# EAGLE design joy (EAGLE 5.01)
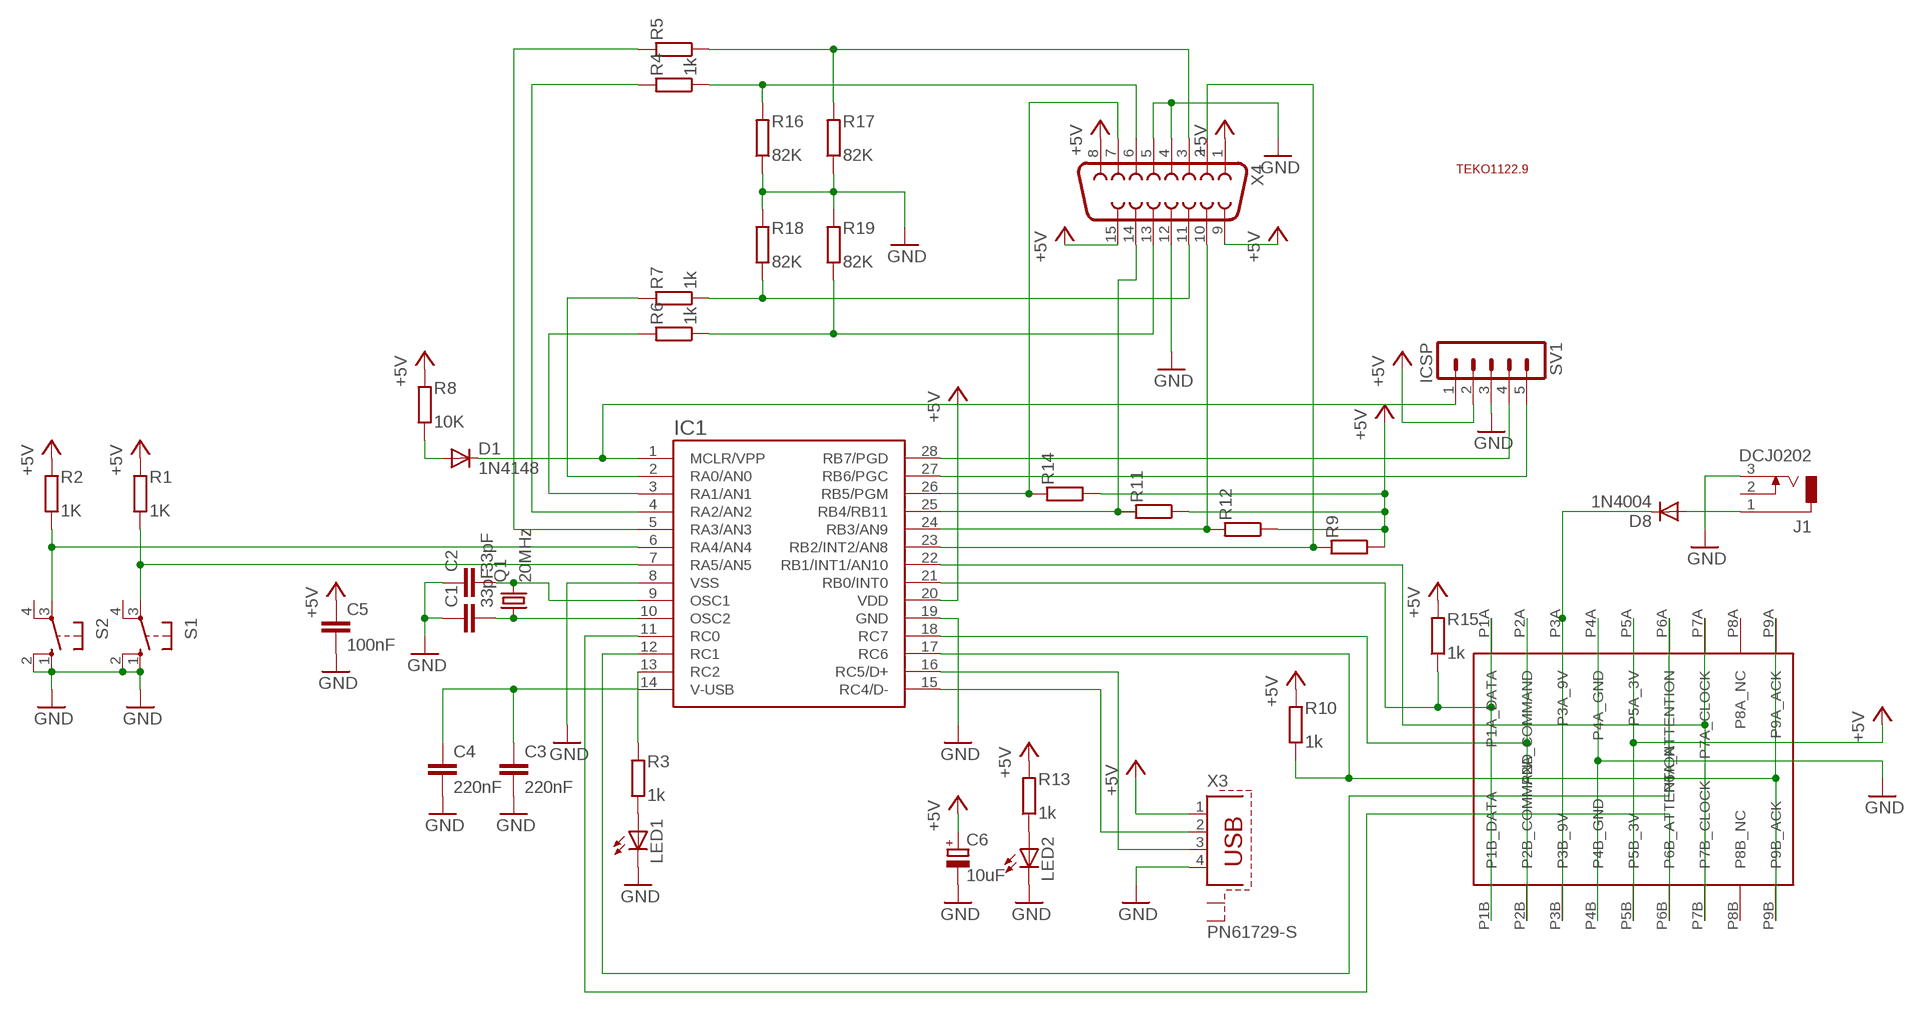
[diagram p0: schematic, sheet 1]

## Parts
C1  33pF  C-EU050-025X075  [C050-025X075]
C2  33pF  C-EU050-025X075  [C050-025X075]
C3  220nF  C-EU050-025X075  [C050-025X075]
C4  220nF  C-EU050-025X075  [C050-025X075]
C5  100nF  C-EU050-025X075  [C050-025X075]
C6  10uF  CPOL-EUE2,5-6E  [E2,5-6E]
D1  1N4148  [DO35-10]
D8  1N4004  [DO41-10]
IC1  PIC18F2550DIL-28  [DIL28]
J1  DCJ0202  [DCJ0202]
LED1  LED3MM  [LED3MM]
LED2  LED3MM  [LED3MM]
Q1  20MHz  CRYSTALHC49U-V  [HC49U-V]
R1  1K  R-EU_0207/10  [0207/10]
R2  1K  R-EU_0207/10  [0207/10]
R3  1k  R-EU_0207/10  [0207/10]
R4  1k  R-EU_0207/10  [0207/10]
R5  1k  R-EU_0207/10  [0207/10]
R6  1k  R-EU_0207/10  [0207/10]
R7  1k  R-EU_0207/10  [0207/10]
R8  10K  R-EU_0207/10  [0207/10]
R9  1k  R-EU_0207/10  [0207/10]
R10  1k  R-EU_0207/10  [0207/10]
R11  1k  R-EU_0207/10  [0207/10]
R12  1k  R-EU_0207/10  [0207/10]
R13  1k  R-EU_0207/10  [0207/10]
R14  1k  R-EU_0207/10  [0207/10]
R15  1k  R-EU_0207/10  [0207/10]
R16  82K  R-EU_0207/10  [0207/10]
R17  82K  R-EU_0207/10  [0207/10]
R18  82K  R-EU_0207/10  [0207/10]
R19  82K  R-EU_0207/10  [0207/10]
S1  10-XX  [B3F-10XX]
S2  10-XX  [B3F-10XX]
SV1  ICSP  MA05-1  [MA05-1]
U$1  TEKO1122.9  [TEKO1122.9]
U$2  PSX_CON_FEMALE  [PSX_FEMALE_COM]
X3  PN61729-S  [PN61729-S]
X4  F15V  [F15V]

## Nets
+5V: C5.1 C6.+ IC1.20(VDD) R1.2 R2.2 R8.2 R9.1 R10.2 R11.1 R12.1 R13.2 R14.1 R15.2 SV1.2 U$2.P5A(P5A_3V) U$2.P5B(P5B_3V) X3.1 X4.1 X4.8 X4.9 X4.15
GND: C1.1 C2.1 C3.2 C4.2 C5.2 C6.- IC1.8(VSS) IC1.19(GND) J1.3 LED1.K(C) LED2.K(C) R16.1 R17.1 R18.2 R19.2 S1.1(S) S1.2(S1) S2.1(S) S2.2(S1) SV1.3 U$2.P4A(P4A_GND) U$2.P4B(P4B_GND) X3.4 X4.4 X4.5 X4.12
N$1: D1.C IC1.1(MCLR/VPP) SV1.1
N$2: IC1.15(RC4/D-) X3.2
N$3: IC1.16(RC5/D+) X3.3
N$4: C3.1 C4.1 IC1.14(V-USB)
N$5: IC1.28(RB7/PGD) SV1.4
N$6: IC1.27(RB6/PGC) SV1.5
N$7: R5.1 R17.2 X4.3
N$8: R4.1 R16.2 X4.6
N$9: IC1.2(RA0/AN0) R7.2
N$10: C2.2 IC1.9(OSC1) Q1.2
N$11: IC1.3(RA1/AN1) R6.2
N$12: C1.2 IC1.10(OSC2) Q1.1
N$13: R6.1 R19.1 X4.13
N$14: R7.1 R18.1 X4.11
N$15: IC1.4(RA2/AN2) R4.2
N$16: IC1.5(RA3/AN3) R5.2
N$17: IC1.26(RB5/PGM) R14.2 X4.7
N$18: IC1.25(RB4/RB11) R11.2 X4.14
N$19: IC1.24(RB3/AN9) R12.2 X4.10
N$20: IC1.23(RB2/INT2/AN8) R9.2 X4.2
N$21: IC1.6(RA4/AN4) R2.1 S2.3(P)
N$22: IC1.7(RA5/AN5) R1.1 S1.3(P)
N$23: IC1.22(RB1/INT1/AN10) U$2.P7A(P7A_CLOCK) U$2.P7B(P7B_CLOCK)
N$24: IC1.21(RB0/INT0) R15.1 U$2.P1A(P1A_DATA) U$2.P1B(P1B_DATA)
N$25: IC1.18(RC7) U$2.P2A(P2A_COMMAND) U$2.P2B(P2B_COMMAND)
N$26: IC1.17(RC6) R10.1 U$2.P9A(P9A_ACK) U$2.P9B(P9B_ACK)
N$27: IC1.11(RC0) U$2.P6B(P6B_ATTENTION)
N$28: IC1.12(RC1) U$2.P6A(P6A_ATTENTION)
N$29: LED1.A R3.1
N$30: IC1.13(RC2) R3.2
N$31: D8.A J1.1
N$32: D8.C U$2.P3A(P3A_9V) U$2.P3B(P3B_9V)
N$40: D1.A R8.1
N$92: LED2.A R13.1
Unconnected: J1.2 S1.4(P1) S2.4(P1) U$2.P8A(P8A_NC) U$2.P8B(P8B_NC) X3.S1 X3.S2

## Library data of the parts
C1-C5 = rcl:C-EU: CAPACITOR, European symbol
C6 = rcl:CPOL-EU: POLARIZED CAPACITOR, European symbol
D1 = diode:1N4148: DIODE high speed (Philips)
D8 = diode:1N4004: DIODE general purpose rectifier, 1 A
IC1 = pic18f2550:PIC18F2550: PIC18F2550 Richard Myrick T. Arellaga April 2010
J1 = con-jack:DCJ0202: DC POWER JACK Source: DCJ0202.pdf
LED1 LED2 = led:LED: LED OSRAM: - CHIPLED LG R971, LG N971, LY N971, LG Q971, LY Q971, LO R971, LY R971 LH N974, LH R974 LS Q976, LO Q976, LY Q976 LO Q996 - Hyper CHIPLED LW Q18S LB Q993, LB Q99A, LB R99A - SideLED LS A670, LO A670, LY A670, LG A670, LP A670 LB A673, LV A673, LT A673, LW A673 LH A674 LY A675 LS A676, LA A676, LO A676, LY A676, LW A676 LS A679, LY A679, LG A679 - Hyper Micro SIDELED® LS Y876, LA Y876, LO Y876, LY Y876 LT Y87S - SmartLED LW L88C, LW L88S LB L89C, LB L89S, LG L890 LS L89K, LO L89K, LY L89K LS L896, LA L896, LO L896, LY L896 - TOPLED LS T670, LO T670, LY T670, LG T670, LP T670 LSG T670, LSP T670, LSY T670, LOP T670, LYG T670 LG T671, LOG T671, LSG T671 LB T673, LV T673, LT T673, LW T673 LH T674 LS T676, LA T676, LO T676, LY T676, LB T676, LH T676, LSB T676, LW T676 LB T67C, LV T67C, LT T67C, LS T67K, LO T67K, LY T67K, LW E67C LS E67B, LA E67B, LO E67B, LY E67B, LB E67C, LV E67C, LT E67C LW T67C LS T679, LY T679, LG T679 LS T770, LO T770, LY T770, LG T770, LP T770 LB T773, LV T773, LT T773, LW T773 LH T774 LS E675, LA E675, LY E675, LS T675 LS T776, LA T776, LO T776, LY T776, LB T776 LHGB T686 LT T68C, LB T68C - Hyper Mini TOPLED® LB M676 - Mini TOPLED Santana® LG M470 LS M47K, LO M47K, LY M47K Source: http://www.osram.convergy.de - LUMILED® LXK2-PW12-R00, LXK2-PW12-S00, LXK2-PW14-U00, LXK2-PW14-V00 LXK2-PM12-R00, LXK2-PM12-S00, LXK2-PM14-U00 LXK2-PE12-Q00, LXK2-PE12-R00, LXK2-PE12-S00, LXK2-PE14-T00, LXK2-PE14-U00 LXK2-PB12-K00, LXK2-PB12-L00, LXK2-PB12-M00, LXK2-PB14-N00, LXK2-PB14-P00, LXK2-PB14-Q00 LXK2-PR12-L00, LXK2-PR12-M00, LXK2-PR14-Q00, LXK2-PR14-R00 LXK2-PD12-Q00, LXK2-PD12-R00, LXK2-PD12-S00 LXK2-PH12-R00, LXK2-PH12-S00 LXK2-PL12-P00, LXK2-PL12-Q00, LXK2-PL12-R00 Source: www.luxeon.com
Q1 = crystal:CRYSTAL: CRYSTAL
R1-R19 = rcl:R-EU_: RESISTOR, European symbol
S1 S2 = switch-omron:10-XX: OMRON SWITCH
SV1 = con-lstb:MA05-1: PIN HEADER
U$1 = nuccio_lib:TEKO1122.9
U$2 = nuccio_lib:PSX_CON_FEMALE
X3 = con-berg:PN61729-S: BERG USB connector
X4 = con-subd:F15: SUB-D

## Board
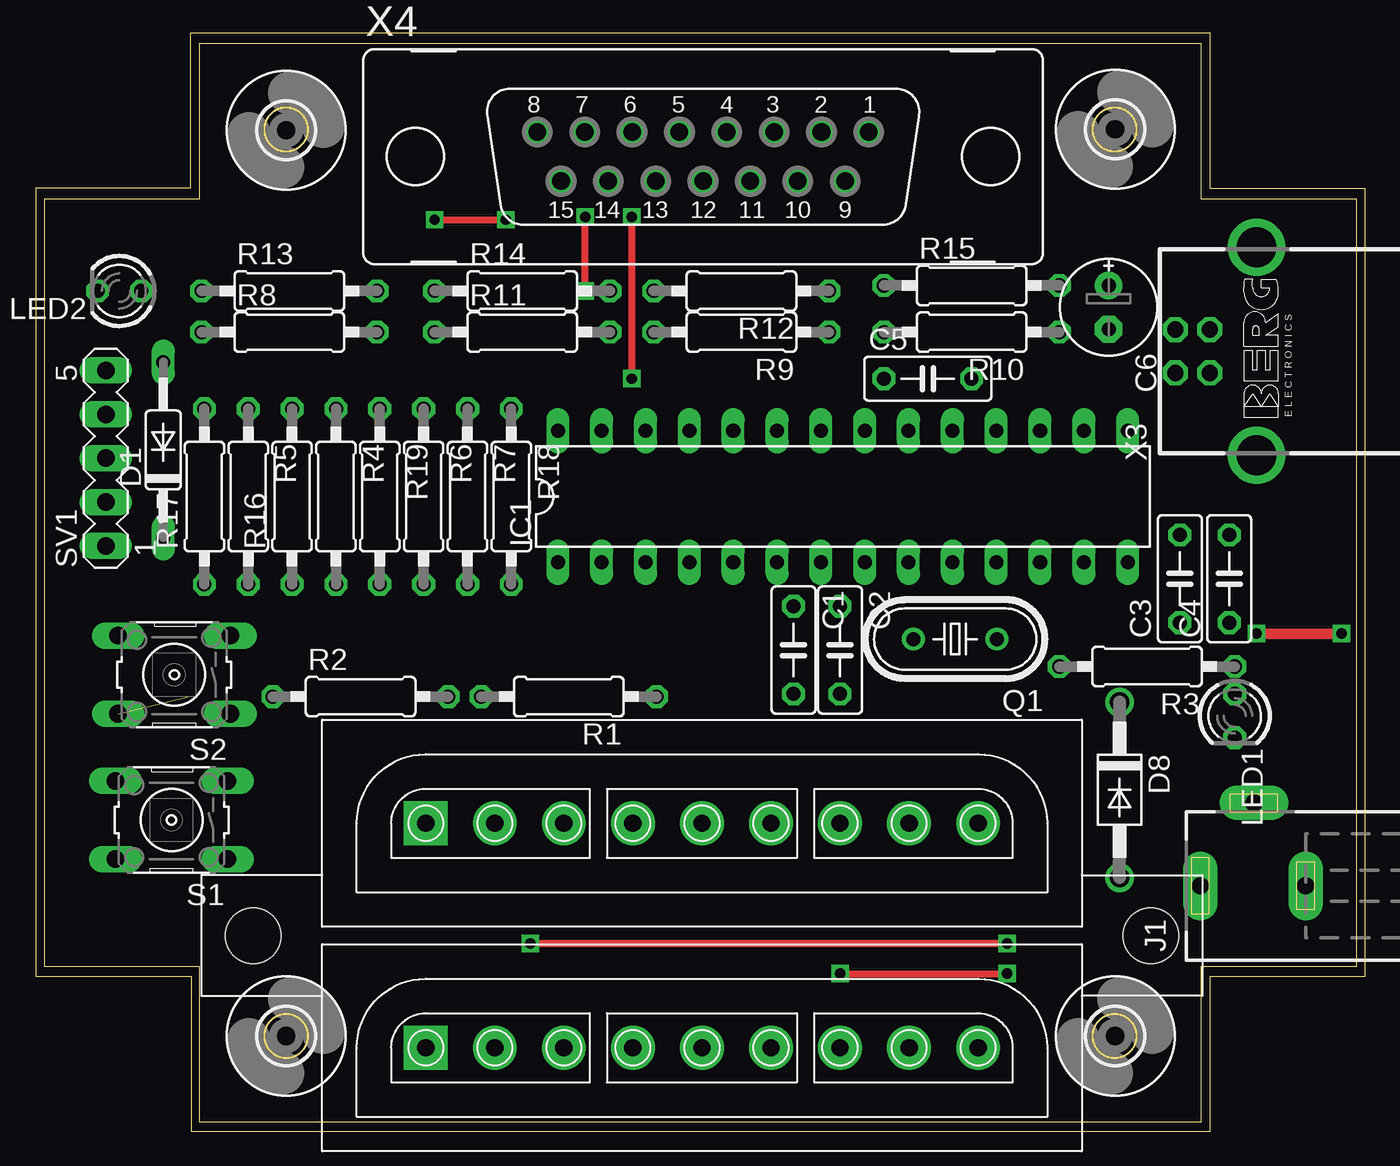
[diagram p1: board, top side]
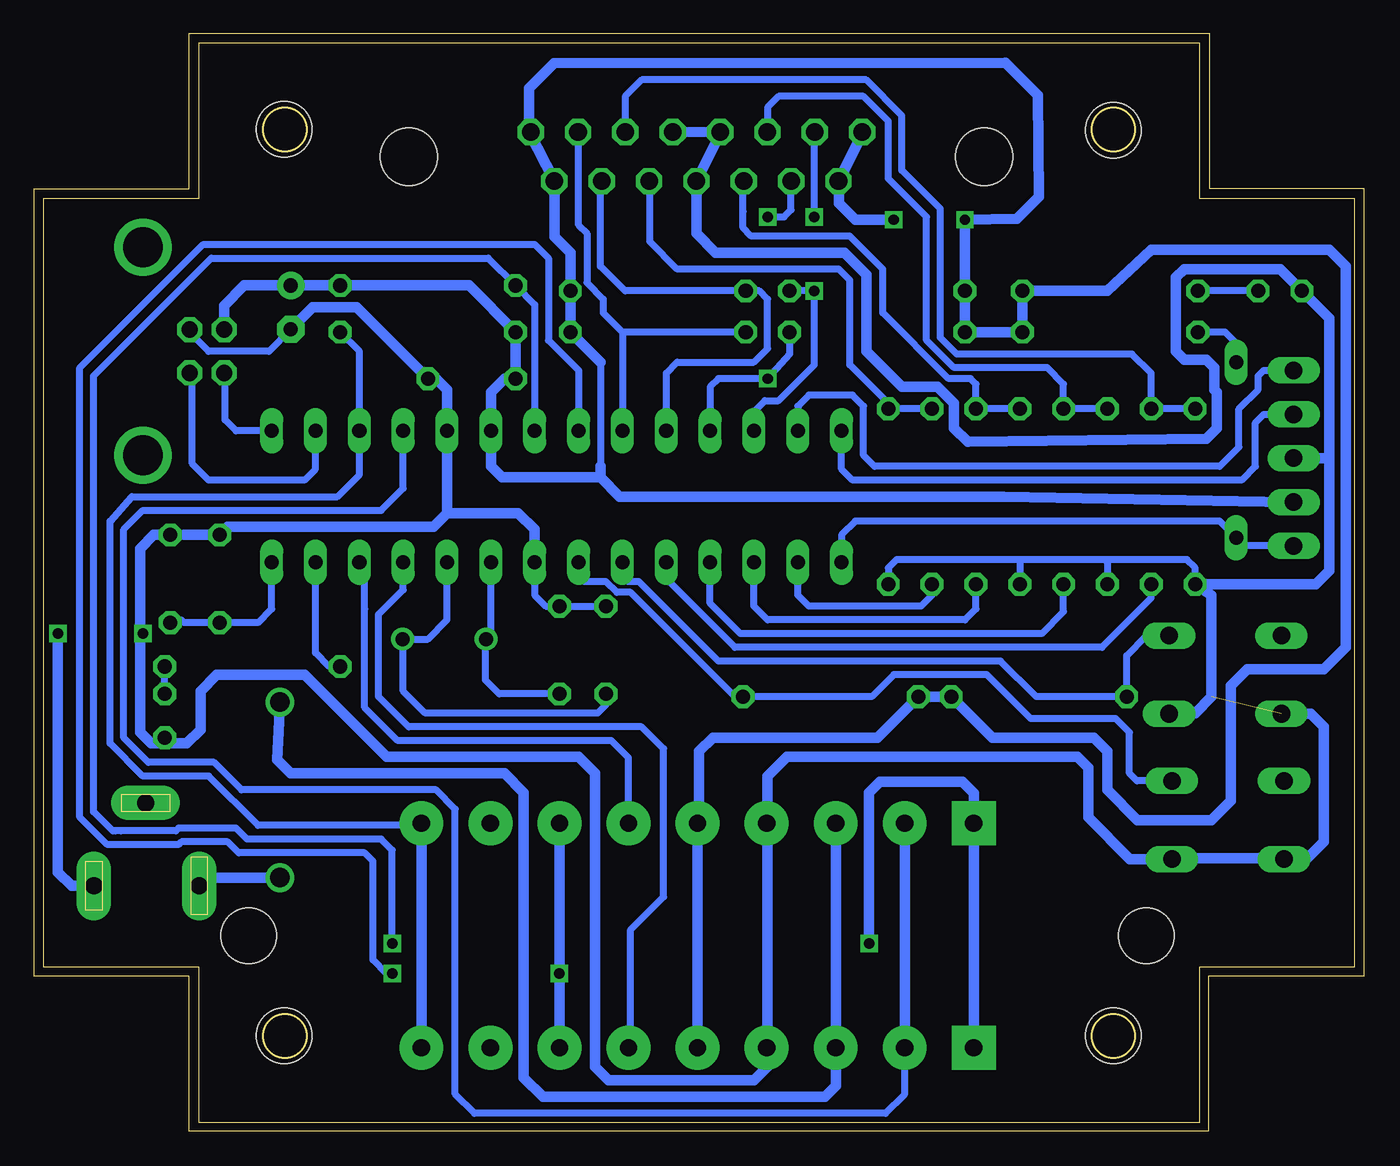
[diagram p2: board, bottom side, seen from below]

Size 76 x 62.5 mm. Coordinates in mm from the lower left corner, seen from the top.
Copper layers (1*16): Top 0.035mm / dielectric 1.5mm / Bottom 0.035mm
Design rules "default *": minimum track width 10mil, minimum drill 24mil, track to track 0.3mm, track to pad 0.3mm, pad to pad 0.3mm, via to via 0.3mm, smd to smd 0.3mm, copper to edge 40mil, drill to drill 8mil, minimum pad ring 10mil, minimum via ring 8mil, stop-mask expansion 4mil, vias tented up to drill 0mil, thermal gap 10mil
Milling: 12 lines

### Footprints (pad centres in the part's own frame; a part is rotated, then mirrored left to right if it is on the bottom)
C050-025X075 = drill 0.813 octagon: 1 -2.54,0; 2 2.54,0
E2,5-6E = drill 0.813 pad 1.575 round: + -1.27,0 | drill 0.813 pad 1.575 octagon: - 1.27,0
DO35-10 = drill 0.813 long: A 5.08,0; C -5.08,0
DO41-10 = drill 1.118 round: A 5.08,0; C -5.08,0
DIL28 = drill 0.813 long: 1 -16.51,-3.81; 2 -13.97,-3.81; 3 -11.43,-3.81; 4 -8.89,-3.81; 5 -6.35,-3.81; 6 -3.81,-3.81; 7 -1.27,-3.81; 8 1.27,-3.81; 9 3.81,-3.81; 10 6.35,-3.81; 11 8.89,-3.81; 12 11.43,-3.81; 13 13.97,-3.81; 14 16.51,-3.81; 15 16.51,3.81; 16 13.97,3.81; 17 11.43,3.81; 18 8.89,3.81; 19 6.35,3.81; 20 3.81,3.81; 21 1.27,3.81; 22 -1.27,3.81; 23 -3.81,3.81; 24 -6.35,3.81; 25 -8.89,3.81; 26 -11.43,3.81; 27 -13.97,3.81; 28 -16.51,3.81
DCJ0202 = drill 1 pad 2 long: 1 0,3.1; 2 4.8,0; 3 0,-3
LED3MM = drill 0.813 octagon: A -1.27,0; K 1.27,0
HC49U-V = drill 0.813 round: 1 -2.413,0; 2 2.413,0
0207/10 = drill 0.813 octagon: 1 -5.08,0; 2 5.08,0
B3F-10XX = drill 1.016 long: 1 -3.251,2.261; 2 3.251,2.261; 3 -3.251,-2.261; 4 3.251,-2.261
MA05-1 = drill 1.016 long: 1 -5.08,0; 2 -2.54,0; 3 0,0; 4 2.54,0; 5 5.08,0
PSX_FEMALE_COM = drill 1 pad 2.54 square: P1A 6,6; P1B 6,-7 | drill 1 pad 2.54 round: P2A 10,6; P2B 10,-7; P3A 14,6; P3B 14,-7; P4A 18,6; P4B 18,-7; P5A 22,6; P5B 22,-7; P6A 26,6; P6B 26,-7; P7A 30,6; P7B 30,-7; P8A 34,6; P8B 34,-7; P9A 38,6; P9B 38,-7 | hole 3.2: -4,-0.5; 48,-0.5
3,2 = hole 3.2: 0,0
PN61729-S = drill 0.95 octagon: 1 1.25,4.71; 2 -1.25,4.71; 3 -1.25,2.71; 4 1.25,2.71 | drill 2.3 pad 2.9 round: S1 -6.02,0; S2 6.02,0
F15V = drill 1.016 octagon: 1 9.601,1.422; 2 6.858,1.422; 3 4.115,1.422; 4 1.372,1.422; 5 -1.372,1.422; 6 -4.115,1.422; 7 -6.858,1.422; 8 -9.601,1.422; 9 8.23,-1.422; 10 5.486,-1.422; 11 2.743,-1.422; 12 0,-1.422; 13 -2.743,-1.422; 14 -5.486,-1.422; 15 -8.23,-1.422 | hole 3.302: 16.662,0; -16.662,0

### Placement (x,y rotation side)
C1  43.39,27.35 270 top
C2  46.09,27.35 270 top
C3  65.78,31.48 90 top
C4  68.63,31.48 90 top
C5  51.17,43.07 0 top
C6  61.65,47.2 270 top
D1  6.88,38.94 90 top
D8  62.28,19.26 270 top
IC1  46.25,36.24 0 top
J1  70.06,13.7 90 top
LED1  68.95,23.54 270 top
LED2  4.34,48.15 180 top
Q1  52.76,27.99 180 top
R1  30.37,24.65 180 top
R2  18.31,24.65 0 top
R3  63.87,26.4 180 top
R4  16.88,36.24 270 top
R5  11.8,36.24 270 top
R6  21.96,36.24 270 top
R7  24.5,36.24 270 top
R8  14.18,45.77 0 top
R9  40.38,45.77 180 top
R10  53.71,45.77 180 top
R11  27.68,45.77 0 top
R12  40.38,48.15 180 top
R13  14.18,48.15 0 top
R14  27.68,48.15 0 top
R15  53.71,48.47 0 top
R16  14.34,36.24 90 top
R17  9.26,36.24 90 top
R18  27.04,36.24 270 top
R19  19.42,36.24 270 top
S1  7.36,17.51 180 top
S2  7.51,25.92 180 top
SV1  3.55,38.46 90 top
U$1  37.2,30.84 0 top
U$2  16.09,11.32 0 top
U$3  [3,2]  14,5 0 top
U$4  [3,2]  62.03,5 0 top
U$5  [3,2]  62.03,57.52 0 top
U$6  [3,2]  14,57.46 0 top
X3  70.22,44.66 90 top
X4  38.15,55.93 0 top

### Tracks (layer width: path | path; a pad name or v marks a point on that pad's centre or on a via)
+5V  (via drill 0.6)
  Top 0.406: v22.6,52.28 v26.72,52.28
  Bottom 0.406: 3.7,35.92 SV1.2 | R14.1 22.75,48.31 | 43.71,44.02 43.71,37.99 | 47.84,57.36 47.76,57.36 X4.1 47.83,57.35 47.84,57.36
  Bottom 0.61: 22.6,45.93 R14.1 22.6,51.96 v22.6,52.28 19.58,52.33 18.31,53.6 18.36,59.47 20.26,61.38 46.41,61.32 47.84,59.9 47.84,57.36 | R13.2 14.34,48.15 11.8,50.53 1.48,50.53 0.53,49.58 0.53,33.7 0.53,32.43 0.53,27.51 1.8,26.24 6.24,26.24 7.2,25.29 7.2,18.62 8.31,17.51 12.59,17.51 14.34,19.26 14.34,21.48 15.13,22.27 21.01,22.27 R2.2 R1.2 27.68,22.27 37.2,22.27 37.99,21.48 37.99,17.51 38.15,17.35 38.12,17.32 U$2.P5A 38.09,4.24 | R13.2 | 43.71,44.02 R9.1 R12.1 45.46,50.37 46.38,51.3 X4.9 47.84,57.36 | 43.71,37.99 43.71,37.35 | 43.71,37.35 49.42,37.35 50.06,37.99 IC1.20 50.06,42.27 49.27,43.07 C5.1 R10.2 51.33,48.47 R15.2 C6.+ 64.35,48.47 65.51,47.3 X3.1 | v26.72,52.28 28.95,52.28 29.9,53.23 29.9,54.5 X4.15 28.47,57.36 X4.8 | 47.84,57.36 X4.1 | 38.09,4.24 U$2.P5B | 38.09,4.24 38.15,4.17 | 22.6,45.93 R11.1 | R8.2 22.44,45.77 22.6,45.93 | R8.2 | R13.2 R8.2 | R8.2 | 3.7,35.92 20.37,36.24 21.8,36.24 42.6,36.24 43.71,37.35
GND  (via drill 0.6)  (1 unrouted)
  Top 0.61: v70.22,28.3 v75.14,28.3
  Bottom 0.406: C3.2 | C3.2 | SV1.3 3.7,38.46 | 10.69,23.7 10.73,23.66 S2.1 | C4.2 67.84,34.02 | 67.84,34.02 | C2.1 | C2.1 C1.1 | IC1.8 47.52,30.53 46.88,29.89 C2.1 | C6.- 62.92,44.66 66.41,44.66 67.52,45.77 67.52,45.92 | 67.52,45.92 67.52,45.93 | 67.52,45.92 X3.4 | R17.1 9.26,32.11 9.74,32.59 14.5,32.59 | 14.5,32.59 19.42,32.59 | 19.42,32.59 R19.2 | R16.1 14.34,32.43 14.5,32.59 | 9.42,31 | 9.42,31 R17.1 | R17.1 9.42,31 | R18.2 27.04,32.11 26.56,32.59 19.42,32.59 | C5.2
  Bottom 0.61: 52.6,35.29 IC1.19 52.6,42.43 53.23,43.07 C5.2 57.84,47.2 60.38,47.2 C6.- | 52.6,35.29 53.39,34.5 65.3,34.5 C3.2 | C3.2 | 10.69,23.7 9.26,23.7 8.31,24.65 8.31,30.53 R17.1 2.28,31.16 1.48,31.96 1.48,38.46 | 67.84,34.02 C3.2 | S2.2 2.55,23.66 1.8,22.91 1.8,16.24 2.75,15.29 4.02,15.29 | 4.02,15.29 10.53,15.29 10.57,15.25 S1.1 13.03,15.25 15.45,17.67 15.45,20.53 16.09,21.16 32.91,21.16 34.03,20.05 34.03,17.19 | S1.2 4.06,15.25 4.02,15.29 | C6.- | X4.4 39.58,57.36 X4.5 36.72,57.36 X4.12 38.15,52.6 38.15,51.48 37.04,50.37 29.58,50.37 28.31,49.1 28.31,44.66 26.25,42.59 24.18,42.59 23.23,41.64 23.23,40.21 22.44,39.42 8.63,39.58 7.99,40.21 7.99,42.27 8.15,42.43 8.15,43.7 8.63,44.18 9.9,44.18 10.37,44.66 10.37,48.94 9.9,49.42 4.34,49.42 LED2.K | 52.6,35.29 48.47,35.29 47.52,34.34 IC1.8 | 34.03,17.19 34.09,17.25 U$2.P4A | 34.04,4.32 34.03,4.33 34.03,17.19 | 34.04,4.32 U$2.P4B | 34.04,4.32 34.04,3.21 34.82,2.43 43.23,2.43 44.03,3.22 44.03,20.21 44.98,21.16 56.09,21.16 60.85,25.92 65.93,25.92 66.89,24.97 66.89,22.75 67.68,21.95 68.79,21.95 68.95,21.95 | C4.2 69.59,34.02 70.38,33.23 70.38,27.99 | 68.95,21.95 69.74,21.95 70.38,22.59 70.38,27.99 | 68.95,21.95 LED1.K | J1.3 74.35,13.7 75.14,14.49 v75.14,28.3 | 70.38,27.99 v70.22,28.3 | 3.86,38.46 SV1.3 1.48,38.46 | LED2.K 1.48,46.56 1.48,38.46 | LED2.K | LED2.K
N$1
  Bottom 0.406: 9.9,34.81 28.95,34.81 29.74,34.02 IC1.1 | 9.9,34.81 | D1.C | 9.9,34.81 7.83,34.81 D1.C | D1.C 6.4,33.38 SV1.1
N$2
  Bottom 0.406: IC1.15 64.82,40.05 65.46,40.69 65.46,43.54 65.48,43.56 X3.2
N$3
  Bottom 0.406: IC1.16 60.22,37.83 60.85,37.19 66.41,37.19 67.36,38.15 67.36,43.23 67.68,43.54 67.66,43.56 X3.3
N$4
  Bottom 0.406: IC1.14 62.76,29.73 63.55,28.94 65.14,28.94 C3.1 67.84,28.94 68,29.1 C4.1
N$5
  Bottom 0.406: IC1.28 29.74,37.83 29.1,37.19 8.78,37.19 6.56,37.19 5.77,37.99 5.77,40.53 5.29,41 SV1.4
N$6
  Bottom 0.406: IC1.27 32.44,40.05 32.28,40.21 32.28,41.48 31.64,42.12 29.1,42.12 28.47,41.48 28.47,38.62 27.83,37.99 7.83,37.99 6.72,39.1 6.72,41.32 5.61,42.43 5.61,43.23 5.29,43.54 SV1.5
N$7
  Bottom 0.406: X4.3 42.27,57.5 42.28,57.51 42.28,59.42 41.33,60.37 28.31,60.37 26.25,58.31 26.25,55.13 24.02,52.91 24.02,45.45 23.07,44.5 12.91,44.5 11.8,43.39 R5.1 | R5.1 | R17.2 R5.1
N$8
  Bottom 0.406: X4.6 34.03,57.36 34.03,58.78 33.39,59.42 28.47,59.42 27.04,57.99 27.04,54.66 24.82,52.43 24.82,45.29 23.23,43.7 17.83,43.7 16.88,42.75 R4.1 R16.2
N$9
  Bottom 0.406: R7.2 24.5,30.53 25.14,29.89 31.64,29.89 32.28,30.53 IC1.2
N$10
  Bottom 0.406: 50.38,27.99 | 50.38,27.99 | IC1.9 50.06,28.46 50.38,27.99 | C2.2 49.58,24.81 50.38,25.61 50.38,27.99 | 50.38,27.99 | 50.38,27.99 Q1.2
N$11
  Bottom 0.406: R6.2 21.96,29.73 22.6,29.1 34.03,29.1 34.82,29.89 IC1.3
N$12
  Bottom 0.406: C1.2 43.39,24.18 43.87,23.7 53.87,23.7 55.14,24.97 55.14,27.99 54.98,27.99 Q1.1 54.82,27.99 53.71,27.99 52.6,29.1 IC1.10
N$13
  Bottom 0.406: R6.1 | R6.1 | R6.1 21.96,42.75 22.28,43.07 23.55,43.07 27.36,46.88 27.36,49.42 29.26,51.32 34.98,51.32 35.45,51.8 35.45,52.75 | 35.45,52.75 | X4.13 35.45,54.5 35.45,52.75 | R6.1 | R19.1 R6.1
N$14
  Bottom 0.406: X4.11 40.86,54.5 40.85,54.5 40.85,51.01 39.26,49.42 29.9,49.42 29.26,48.78 29.26,45.13 29.26,43.86 27.04,41.64 R18.1 | R18.1 | R7.1 R18.1 | R18.1
N$15
  Bottom 0.406: R4.2 16.88,29.57 18.15,28.3 35.61,28.3 37.36,30.05 37.36,32.11 37.36,32.27 IC1.4
N$16
  Bottom 0.406: R5.2 | R5.2 11.8,30.37 14.66,27.51 35.93,27.51 39.9,31.48 IC1.5 | IC1.5
N$17  (via drill 0.6)
  Top 0.406: v31.33,48.15 v31.33,52.43
  Bottom 0.406: v31.33,48.15 R14.2 | 31.33,47.99 v31.33,48.15 | 31.33,47.99 31.33,43.86 33.39,41.8 34.18,41.8 34.82,41.16 IC1.26 | X4.7 31.33,57.32 v31.33,52.43 | v31.33,48.15 | 31.33,47.99 v31.33,48.15
N$18  (via drill 0.6)
  Top 0.406: v34.03,43.07 v34.03,52.43
  Bottom 0.406: R11.2 32.76,44.5 v34.03,43.07 | X4.14 32.67,52.84 33.07,52.43 v34.03,52.43 | v34.03,43.07 | v34.03,43.07 36.88,43.07 37.36,42.59 IC1.25
N$19
  Bottom 0.406: X4.10 43.7,54.5 43.71,54.5 43.71,49.58 42.28,48.15 R12.2 34.5,48.15 34.03,47.67 34.03,44.81 34.82,44.02 39.26,44.02 39.9,43.39 IC1.24
N$20
  Bottom 0.406: 42.44,39.73 IC1.23 42.44,45.77 | R9.2 42.44,45.77 | X4.2 45,57.36 44.98,57.36 44.98,51.96 44.5,51.48 44.5,48.62 43.55,47.67 43.55,46.88 42.44,45.77
N$21
  Bottom 0.406: S2.3 12.08,28.18 13.23,27.03 13.23,24.81 | 13.23,24.81 | R2.1 13.23,24.81 | R2.1 13.23,24.81 | 20.53,26.72 | R2.1 18.47,24.65 20.53,26.72 | 20.53,26.72 36.88,26.72 41.49,31.32 42.12,31.32 42.44,31.64 IC1.6 | IC1.6
N$22
  Bottom 0.406: S1.3 12.63,19.77 13.07,20.21 13.07,22.59 13.86,23.38 18.79,23.38 21.33,25.92 26.72,25.92 27.99,24.65 R1.1 35.93,24.65 41.96,30.69 42.76,30.69 43.39,31.32 44.66,31.32 44.98,31.64 IC1.7 | IC1.7
N$23  (via drill 0.6)
  Top 0.406: v46.09,8.62 v55.77,8.62
  Bottom 0.406: v55.77,8.62 56.09,8.62 56.89,9.41 56.89,15.13 57.36,15.6 64.66,15.6 65.3,16.24 68,16.24 68.16,16.08 72.13,16.08 72.28,16.08 73.87,17.67 73.87,43.7 66.73,50.85 66.41,50.85 52.28,50.85 47.52,50.85 46.73,50.05 46.73,45.29 44.98,43.54 IC1.22 | IC1.22
  Bottom 0.61: U$2.P7B 45.95,4.32 45.93,4.33 46.09,4.49 v46.09,8.62 | v46.09,8.62 U$2.P7A | v46.09,8.62
N$24  (via drill 0.6)
  Top 0.406: v28.15,10.37 v55.77,10.37
  Bottom 0.406: IC1.21 47.52,42.59 47.52,47.35 R15.1 50.22,50.05 66.25,50.05 73.08,43.23 73.08,17.99 71.97,16.87 71.81,16.87 71.49,16.87 68.32,16.87 68.16,17.03 64.82,17.03 64.19,16.4 56.41,16.4 55.77,15.76 v55.77,10.37
  Bottom 0.61: U$2.P1A 22.12,17.35 | U$2.P1A | U$2.P1B U$2.P1A | U$2.P1A | U$2.P1A 22.09,19.06 22.75,19.73 27.52,19.73 28.15,19.1 v28.15,10.37 | v28.15,10.37
N$25
  Bottom 0.406: IC1.18 55.14,36.72 56.41,35.45 70.22,35.45 71.33,34.34 71.33,22.27 69.9,20.84 66.09,20.84 64.51,19.26 53.23,19.26 52.12,18.14 52.12,1.63 51.01,0.52 27.2,0.52 26.09,1.64 26.09,4.33
  Bottom 0.61: U$2.P2B 26.09,4.33 U$2.P2A
N$26
  Bottom 0.406: R10.1 57.68,44.66 57.68,42.12 IC1.17 57.68,37.51 58.95,36.24 70.86,36.24 72.13,34.81 72.13,21.95 70.22,20.05 66.41,20.05 63.55,17.19 54.19,17.19
  Bottom 0.61: U$2.P9A 54.09,17.29 54.19,17.19 54.09,17.09 U$2.P9B
N$27
  Bottom 0.406: IC1.11 55.14,30.84 56.25,29.73 56.57,29.42 56.57,24.65 54.82,22.91 41.33,22.91 40.06,21.64 40.06,13.06 41.96,11.16 41.96,4.49 42.12,4.33 42.11,4.32 U$2.P6B
N$28
  Bottom 0.406: IC1.12 57.36,32.11 57.36,29.73 57.36,24.02 55.46,22.11 43.07,22.11 42.09,21.13 U$2.P6A
N$29
  Bottom 0.406: R3.1 | LED1.A R3.1
N$30
  Bottom 0.406: R3.2 59.43,26.4 60.22,27.19 IC1.13
N$31
  Bottom 0.61: J1.1 66.89,13.7 66.89,14.18 D8.A
N$32
  Bottom 0.61: 30.06,4.32 30.06,4.17 | 30.06,4.32 U$2.P3B 30.07,4.32 30.06,4.33 | U$2.P3A 30.06,17.32 30.06,4.33 | 30.06,4.33 30.06,4.32 | D8.C 62.44,21 61.65,20.21 49.27,20.21 48.15,19.1 48.15,2.59 47.04,1.48 30.69,1.48 30.06,2.11 30.06,4.33
N$40
  Bottom 0.406: D1.A 6.88,45.13 7.51,45.77 R8.1 | R8.1
N$92
  Bottom 0.406: R13.1 | R13.1 9.1,48.31 | LED2.A R13.1